# Altium project Xi410_Temp_Probe.PrjPcb
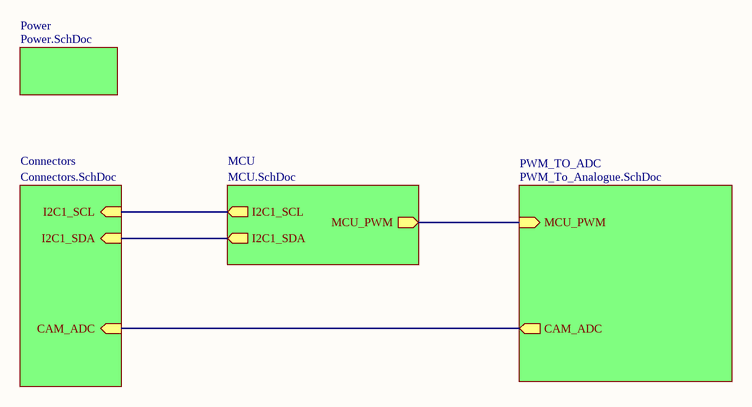
[diagram p0: Structure.SchDoc]
5 sheets, 37 parts. Net scope: hierarchical (ports join the sheet entries above them; power ports are global).
Board file: PCB1.PcbDoc
Sheets:
  Structure.SchDoc
    Connectors = Connectors.SchDoc
    MCU = MCU.SchDoc
    PWM_TO_ADC = PWM_To_Analogue.SchDoc
    Power = Power.SchDoc

## Sheet Structure.SchDoc
size A4; Organization: Test; Address1: L3, 12a Rodborough Rd; Address2: Frenchs Forest; Address3: NSW; Address4: Australia 2086

### Sub-sheets
Connectors = Connectors.SchDoc: I2C1_SCL (in), I2C1_SDA (in), CAM_ADC (in)
MCU = MCU.SchDoc: I2C1_SCL (out), I2C1_SDA (out), MCU_PWM (out)
Power = Power.SchDoc: no entries
PWM_TO_ADC = PWM_To_Analogue.SchDoc: MCU_PWM (in), CAM_ADC (out)

### Nets
I2C1_SCL: sheet Connectors/I2C1_SCL, sheet MCU/I2C1_SCL
I2C1_SDA: sheet Connectors/I2C1_SDA, sheet MCU/I2C1_SDA
TIM1_CH4_PWM: sheet MCU/MCU_PWM, sheet PWM_TO_ADC/MCU_PWM
NetU2#1_1: sheet Connectors/CAM_ADC, sheet PWM_TO_ADC/CAM_ADC

### Notes on the sheet
- Title
- Size:
- Date:
- A4
- Number:
- Time:
- Revision:
- Sheet
- of
- File:

## Sheet Connectors.SchDoc
size A4; Organization: Altium Limited; Address1: L3, 12a Rodborough Rd; Address2: Frenchs Forest; Address3: NSW; Address4: Australia 2086
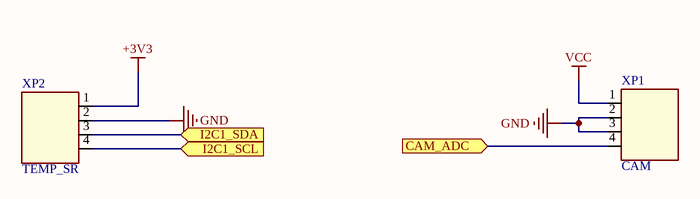
[diagram p1: Connectors.SchDoc]

### Parts
XP1  CAM  [HEAD-SMD-2.54/4]
XP2  TEMP_SR  [HEAD-SMD-2.54/4]

### Ports
CAM_ADC (in), I2C1_SCL (in), I2C1_SDA (in)

### Nets
+3V3: XP2.1
GND: XP1.2 XP1.3 XP2.2
VCC: XP1.1
I2C1_SCL: XP2.4 ; port I2C1_SCL
I2C1_SDA: XP2.3 ; port I2C1_SDA
NetU2#1_1: XP1.4 ; port CAM_ADC

### Notes on the sheet
- Title
- Size:
- Date:
- A4
- Number:
- Time:
- Revision:
- Sheet
- of
- File:

### Library data of the parts
XP1 XP2 = CON_4

## Sheet MCU.SchDoc
size A4; Organization: Altium Limited; Address1: L3, 12a Rodborough Rd; Address2: Frenchs Forest; Address3: NSW; Address4: Australia 2086
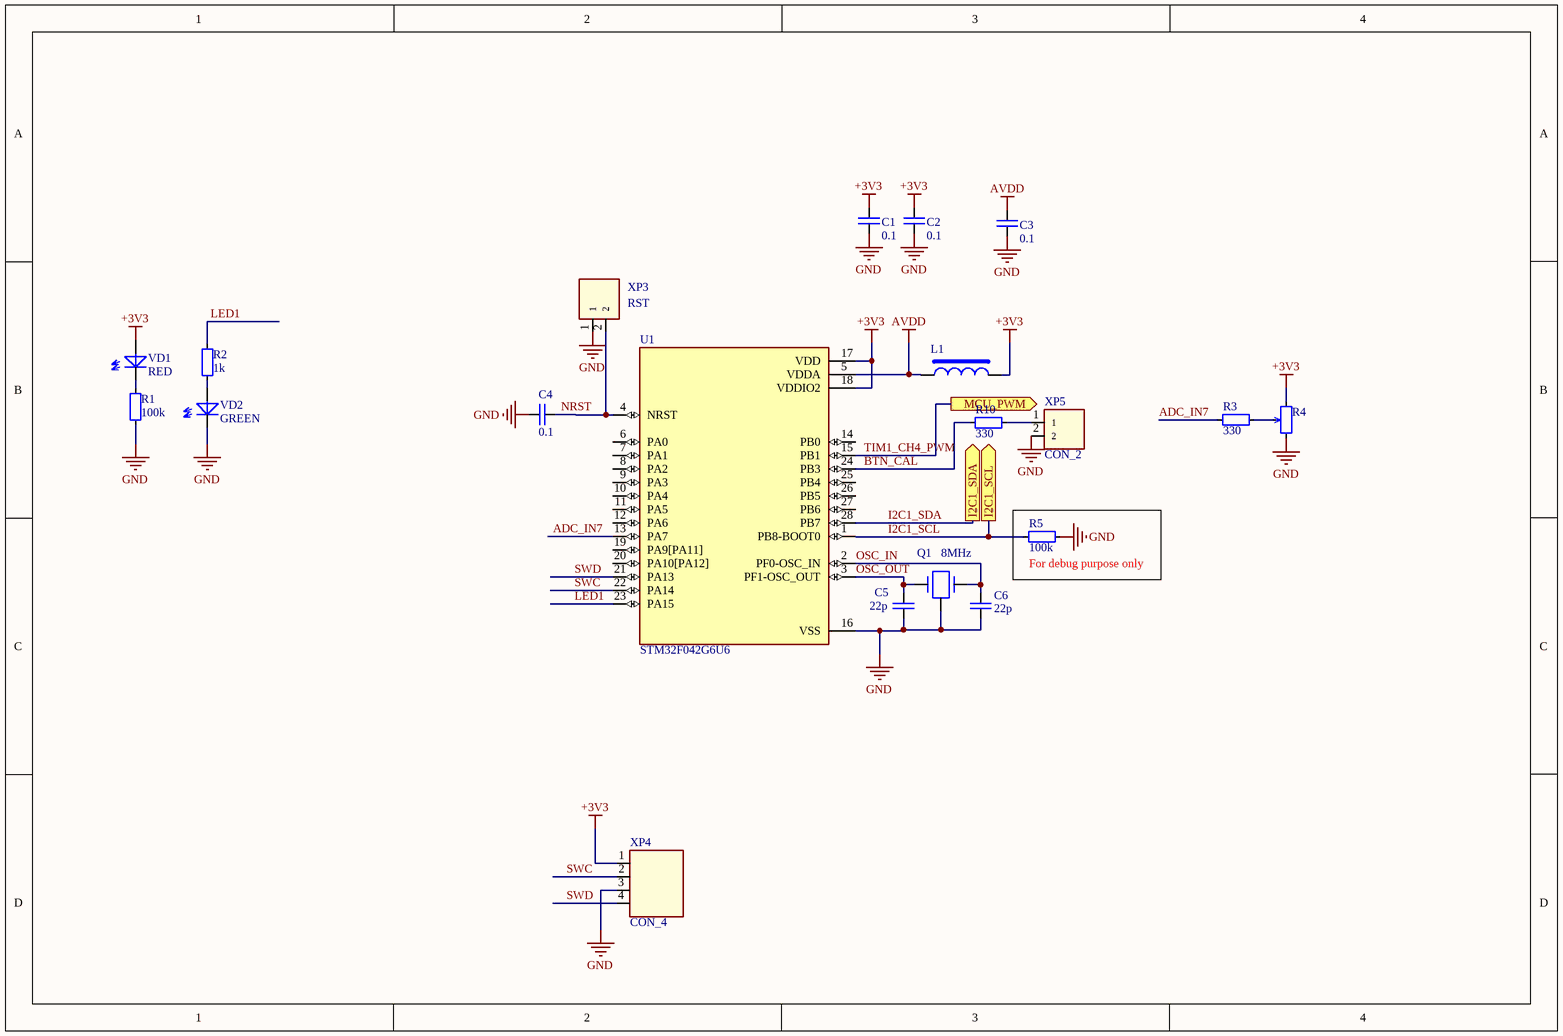
[diagram p2: MCU.SchDoc]

### Parts
C1  0.1  [CAP_0603]
C2  0.1  [CAP_0603]
C3  0.1  [CAP_0603]
C4  0.1  [CAP_0603]
C5  22p  [CAP_0603]
C6  22p  [CAP_0603]
L1  (no value)  [SMD_0603]
Q1  8MHz  [CSTCC-CRYSTAL]
R1  100k  [SMD_0603]
R2  1k  [SMD_0603]
R3  330  [SMD_0603]
R4  (no value)  [RES-ADJ-SMD-Panasonic]
R5  100k  [SMD_0603]
R10  330  [SMD_0603]
U1  STM32F042G6U6  [UFQFPN_4x4_STM32F042G6U6]
VD1  RED  [LED_0603]
VD2  GREEN  [LED_0603]
XP3  RST  [HEAD_MICRO_SF_1.27-2]
XP4  CON_4  [HEAD-1/4/2.54]
XP5  CON_2  [HEAD_MICRO_SF_1.27-2]

### Blocks framed on the sheet
For debug purpose only: R5

### Ports
I2C1_SCL (out), I2C1_SDA (out), MCU_PWM (out)

### Nets
+3V3: C1.1 C2.1 L1.2 R4.2 U1.17(VDD) U1.18(VDDIO2) VD1.2(A) XP4.1
AVDD: C3.1 L1.1 U1.5(VDDA)
GND: C1.2 C2.2 C3.2 C4.1 C5.2 C6.2 Q1.2 R1.2 R4.1 R5.1 U1.16(VSS) VD2.1(C) XP3.1 XP4.3 XP5.2
ADC_IN7: R3.2 U1.13(PA7)
BTN_CAL: R10.2 U1.24(PB3)
I2C1_SCL: R5.2 U1.1(PB8-BOOT0) ; port I2C1_SCL
I2C1_SDA: U1.28(PB7) ; port I2C1_SDA
LED1: R2.1 U1.23(PA15)
NRST: C4.2 U1.4(NRST) XP3.2
OSC_IN: C6.1 Q1.1 U1.2(PF0-OSC_IN)
OSC_OUT: C5.1 Q1.3 U1.3(PF1-OSC_OUT)
SWC: U1.22(PA14) XP4.2
SWD: U1.21(PA13) XP4.4
TIM1_CH4_PWM: U1.15(PB1) ; port MCU_PWM
NetR1_1: R1.1 VD1.1(C)
NetR2_2: R2.2 VD2.2(A)
NetR3_1: R3.1 R4.3
NetR10_1: R10.1 XP5.1

Not connected (* = marked no-connect by the designer): U1 6(PA0) 7(PA1) 8(PA2) 9(PA3) 10(PA4) 11(PA5) 12(PA6) 14(PB0) 19(PA9[PA11]) 20(PA10[PA12]) 25(PB4) 26(PB5) 27(PB6)

### Notes on the sheet
- Title
- Size:
- Date:
- A4
- Number:
- Time:
- Revision:
- Sheet
- of
- File:

### Library data of the parts
C1-C6 = C_NONE_POLAR: None polar capacitor; Case: 0603
  C1-C4: Value: 0.1
  C5 C6: Value: 22p
L1 = FB: Ferrite Bread
Q1 = CRYSTAL_CAP: Crystal oscillator; Model: CSTCC8M00G53A-R0; Value: 8MHz
R1-R3 R5 R10 = RES: Resistor
  R1 R5: Value: 100k; Case: 0603
  R2: Value: 1k; Case: 0603
  R3 R10: Value: 330; Case: *
R4 = RES_ADJ: Agjustable resistor
U1 = STM32F042G6U6: ARM Cortex-M0 STM32F0 Microcontroller IC 32-Bit 48MHz 32KB x 8kB FLASH 28-UFQFPN _4x4_; MF: STMicroelectronics; Package: UFQFN-28 STMicroelectronics; Availability: Unavailable; SnapEDA_Link: https://www.snapeda.com/parts/STM32F042G6U6/STMicroelectronics/view-part/225452/?ref=snap; MP: STM32F042G6U6; Price: None; Value: *
VD1 VD2 = LED
  VD1: Value: RED
  VD2: Value: GREEN
XP3 = CON_2

## Sheet PWM_To_Analogue.SchDoc
size A4; Organization: Altium Limited; Address1: L3, 12a Rodborough Rd; Address2: Frenchs Forest; Address3: NSW; Address4: Australia 2086
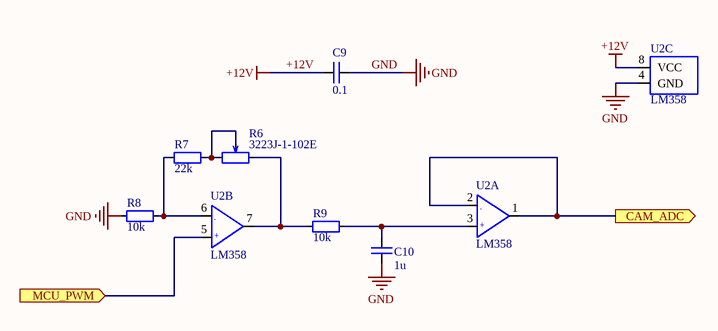
[diagram p3: PWM_To_Analogue.SchDoc]

### Parts
(Parts that share a designator on the sheet are numbered #1, #2 ... from top to bottom, then left to right.)
C9  0.1  [CAP_0603]
C10  1u  [CAP_0603]
R6  3223J-1-102E  [RES-ADJ-SMD-Panasonic]
R7  22k  [SMD_0603]
R8  10k  [SMD_0603]
R9  10k  [SMD_0603]
U2#1  LM358  [SO8-150mil]  (part A of 2)
U2#2  LM358  [SO8-150mil]  (parts B,C of 3)

### Ports
CAM_ADC (out), MCU_PWM (in)

### Nets
+12V: C9.1 U2#2.8(VCC)
GND: C9.2 C10.2 R8.2 U2#2.4(GND)
TIM1_CH4_PWM: U2#2.5 ; port MCU_PWM
NetC10_1: C10.1 R9.1 U2#1.3
NetR6_1: R6.1 R6.3 R7.1
NetR6_2: R6.2 R9.2 U2#2.7
NetR7_2: R7.2 R8.1 U2#2.6
NetU2#1_1: U2#1.1 U2#1.2 ; port CAM_ADC

Not connected (* = marked no-connect by the designer): U2#1 4 8

### Notes on the sheet
- Title
- Size:
- Date:
- A4
- Number:
- Time:
- Revision:
- Sheet
- of
- File:
- (in symbol LM358, part A) -; +
- (in symbol LM358, part B) -; +

### Library data of the parts
C9 C10 = C_NONE_POLAR: None polar capacitor; Case: 0805
  C9: Value: 0.1
  C10: Value: 1u
R6 = RES_ADJ: Agjustable resistor; Value: 3223J-1-102E
R7-R9 = RES: Resistor
  R7: Value: 22k; Case: 0805
  R8: Value: 10k; Case: *
  R9: Value: 10k; Case: 0805
U2#1 U2#2 = LM358: OpAmp; Manufacture: TI; Case: SOIC-8; HelpURL: http://www.ti.com/lit/ds/symlink/lm158-n.pdf; Model: LM358

## Sheet Power.SchDoc
size A4; Organization: Altium Limited; Address1: L3, 12a Rodborough Rd; Address2: Frenchs Forest; Address3: NSW; Address4: Australia 2086
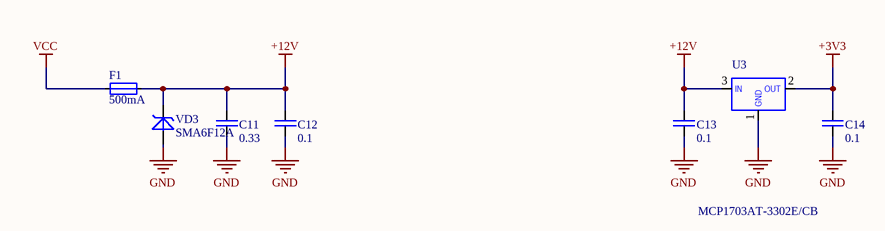
[diagram p4: Power.SchDoc]

### Parts
C11  0.33  [CAP_0805]
C12  0.1  [CAP_0805]
C13  0.1  [CAP_0805]
C14  0.1  [CAP_0805]
F1  500mA  [SMD_1206]
U3  MCP1703AT-3302E/CB  [SOT23-3]
VD3  SMA6F12A  [DO-221AC]

### Nets
+3V3: C14.1 U3.2(OUT)
+12V: C11.1 C12.1 C13.1 F1.1 U3.3(IN) VD3.1
GND: C11.2 C12.2 C13.2 C14.2 U3.1(GND) VD3.2
VCC: F1.2

### Notes on the sheet
- Title
- Size:
- Date:
- A4
- Number:
- Time:
- Revision:
- Sheet
- of
- File:

### Library data of the parts
C11-C14 = C_NONE_POLAR: None polar capacitor; Case: 0805
  C11: Value: 0.33
  C12-C14: Value: 0.1
F1 = FUSE: Resistor; Value: 500mA
U3 = MCP1703A: 250 mA, 16V, Low Quiescent Current LDO Regulator
VD3 = DIOSE_TVS: TVS Diode; Value: SMA6F12A

## Nets that join several sheets
+3V3: Connectors (XP2.1), MCU (8 pins), Power (C14.1 U3.2)
+12V: PWM_To_Analogue (C9.1 U2#2.8), Power (6 pins)
GND: Connectors (XP1.2 XP1.3 XP2.2), MCU (15 pins), PWM_To_Analogue (C9.2 C10.2 R8.2 U2#2.4), Power (6 pins)
VCC: Connectors (XP1.1), Power (F1.2)
I2C1_SCL: Connectors (XP2.4), MCU (R5.2 U1.1)
I2C1_SDA: Connectors (XP2.3), MCU (U1.28)
NetU2#1_1: Connectors (XP1.4), PWM_To_Analogue (U2#1.1 U2#1.2)
TIM1_CH4_PWM: MCU (U1.15), PWM_To_Analogue (U2#2.5)